# Altium schematic sheet TIDA-01576_ADS8686S_ISO_Interface_Pg5-Digital.SchDoc
size 431 x 279 mm; Date: Not shown in title block; ApprovedBy: Not shown in title block; CheckedBy: Not shown in title block; Author: Not shown in title block; CompanyName: Not shown in title block; Engineer: Not shown in title block; Organization: Not shown in title block; Address1: Not shown in title block; Address2: Not shown in title block; Address3: Not shown in title block; Address4: Not shown in title block; DocumentNumber: 1; Revision: Use project parameter SCH_Rev; SheetNumber: 5; SheetTotal: 8; PageSetup: Record=PageOptions|CenterHorizontal=True|CenterVertical=True|PrintScale=1.00|XCorrection=1.00|YCorrection=1.00|PrintKind=0|BorderSize=5000000|LeftOffset=0|BottomOffset=0|Orientation=2|PaperLength=1000|PaperWidth=1000|Scale=100|PaperSource=15|PrintQuality=600|MediaType=1|DitherType=10|PaperKind=Letter|PrintScaleMode=1; CurrentTime: Not shown in title block; CurrentDate: Not shown in title block; Time: Not shown in title block; DocumentFullPathAndName: Not shown in title block; DocumentName: Not shown in title block; ModifiedDate: Not shown in title block; ImagePath: Not shown in title block
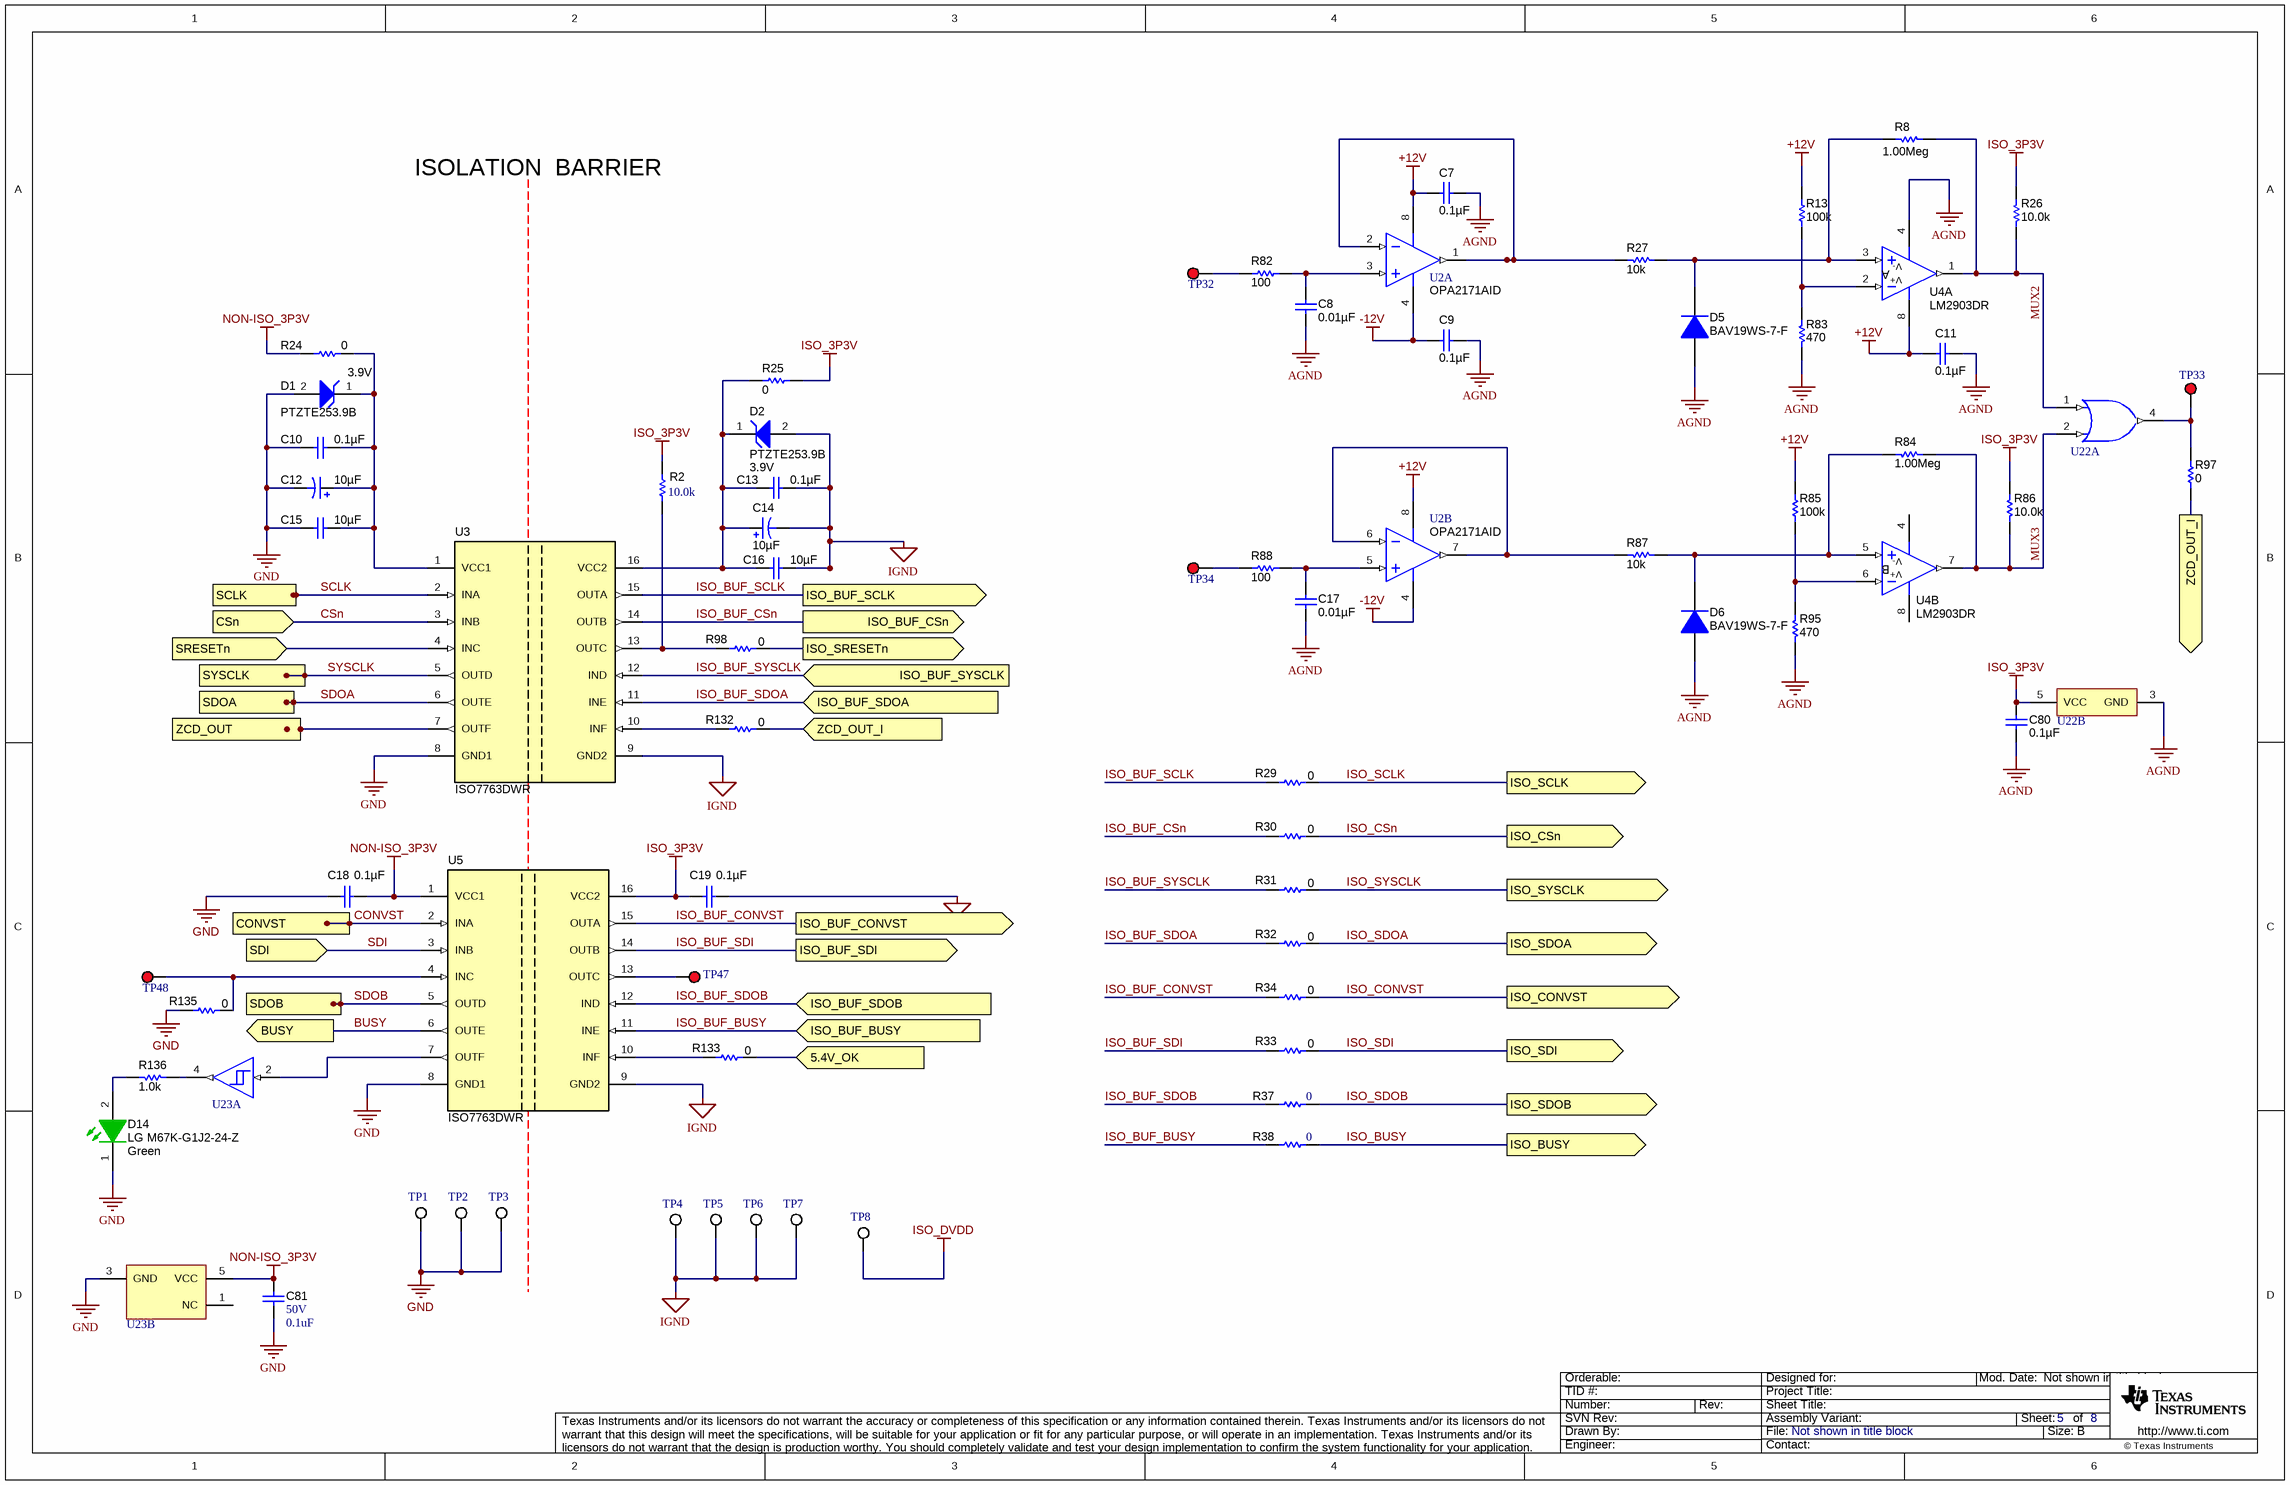
[diagram p0: TIDA-01576_ADS8686S_ISO_Interface_Pg5-Digital.SchDoc]

## Parts
C7  ValueDisplayed: 0.1µF  [0603]  (hidden comment: 06033C104JAT2A)
C8  ValueDisplayed: 0.01µF  [0603]  (hidden comment: C1608C0G1E103J080AA)
C9  ValueDisplayed: 0.1µF  [0603]  (hidden comment: 06033C104JAT2A)
C10  ValueDisplayed: 0.1µF  [0603]  (hidden comment: C0603C104K5RACTU)
C11  ValueDisplayed: 0.1µF  [0603]  (hidden comment: 06033C104JAT2A)
C12  ValueDisplayed: 10µF  [3528-21]  (hidden comment: T491B106K016AT)
C13  ValueDisplayed: 0.1µF  [0603]  (hidden comment: C0603C104K5RACTU)
C14  ValueDisplayed: 10µF  [3528-21]  (hidden comment: T491B106K016AT)
C15  ValueDisplayed: 10µF  [1206_180]  (hidden comment: GRM31CR61H106KA12L)
C16  ValueDisplayed: 10µF  [1206_180]  (hidden comment: GRM31CR61H106KA12L)
C17  ValueDisplayed: 0.01µF  [0603]  (hidden comment: C1608C0G1E103J080AA)
C18  ValueDisplayed: 0.1µF  [0402]  (hidden comment: GRM155R71C104KA88D)
C19  ValueDisplayed: 0.1µF  [0402]  (hidden comment: GRM155R71C104KA88D)
C80  ValueDisplayed: 0.1µF  [0603]  (hidden comment: 06033D104KAT2A)
C81  VDC_V: 50V  ValueDisplayed: 0.1uF  [0603]  (hidden comment: C0603C104K5RACTU)
D1  PTZTE253.9B  value 3.9V  [SMA]
D2  PTZTE253.9B  value 3.9V  [SMA]
D5  BAV19WS-7-F  [SOD-323]
D6  BAV19WS-7-F  [SOD-323]
D14  LG M67K-G1J2-24-Z  value Green  [LG_M67K_Green]
R2  ValueDisplayed: 10.0k  [0402]  (hidden comment: ERJ-2RKF1002X)
R8  value 1.00Meg  [0603]  (hidden comment: CRCW06031M00FKEA)
R13  ValueDisplayed: 100k  [0603]  (hidden comment: RC0603FR-07100KL)
R24  ValueDisplayed: 0  [0603]  (hidden comment: CRCW06030000Z0EA)
R25  ValueDisplayed: 0  [0603]  (hidden comment: CRCW06030000Z0EA)
R26  value 10.0k  [0603]  (hidden comment: CRCW060310K0FKEA)
R27  value 10k  [0603]  (hidden comment: CRCW060310K0FKEA)
R29  ValueDisplayed: 0  [0402]  (hidden comment: ERJ-2GE0R00X)
R30  ValueDisplayed: 0  [0402]  (hidden comment: ERJ-2GE0R00X)
R31  ValueDisplayed: 0  [0402]  (hidden comment: ERJ-2GE0R00X)
R32  ValueDisplayed: 0  [0402]  (hidden comment: ERJ-2GE0R00X)
R33  ValueDisplayed: 0  [0402]  (hidden comment: ERJ-2GE0R00X)
R34  ValueDisplayed: 0  [0402]  (hidden comment: ERJ-2GE0R00X)
R37  ValueDisplayed: 0  [0402]  (hidden comment: ERJ-2GE0R00X)
R38  ValueDisplayed: 0  [0402]  (hidden comment: ERJ-2GE0R00X)
R82  value 100  [0603]  (hidden comment: CRCW0603100RFKEA)
R83  ValueDisplayed: 470  [1206]  (hidden comment: RC1206FR-07470RL)
R84  value 1.00Meg  [0603]  (hidden comment: CRCW06031M00FKEA)
R85  ValueDisplayed: 100k  [0603]  (hidden comment: RC0603FR-07100KL)
R86  value 10.0k  [0603]  (hidden comment: CRCW060310K0FKEA)
R87  value 10k  [0603]  (hidden comment: CRCW060310K0FKEA)
R88  value 100  [0603]  (hidden comment: CRCW0603100RFKEA)
R95  ValueDisplayed: 470  [1206]  (hidden comment: RC1206FR-07470RL)
R97  ValueDisplayed: 0  [0402]  (hidden comment: ERJ-2GE0R00X)
R98  ValueDisplayed: 0  [0402]  (hidden comment: ERJ-2GE0R00X)
R132  ValueDisplayed: 0  [0402]  (hidden comment: ERJ-2GE0R00X)
R133  ValueDisplayed: 0  [0402]  (hidden comment: ERJ-2GE0R00X)
R135  ValueDisplayed: 0  [0402]  (hidden comment: ERJ-2GE0R00X)
R136  ValueDisplayed: 1.0k  [0603]  (hidden comment: RC0603JR-071KL)
TP1  5015  [Testpoint_Keystone_Miniature]  (value not drawn)
TP2  5015  [Testpoint_Keystone_Miniature]  (value not drawn)
TP3  5015  [Testpoint_Keystone_Miniature]  (value not drawn)
TP4  5015  [Testpoint_Keystone_Miniature]  (value not drawn)
TP5  5015  [Testpoint_Keystone_Miniature]  (value not drawn)
TP6  5015  [Testpoint_Keystone_Miniature]  (value not drawn)
TP7  5015  [Testpoint_Keystone_Miniature]  (value not drawn)
TP8  5015  [Testpoint_Keystone_Miniature]  (value not drawn)
TP32  5000  [Keystone5000]  (value not drawn)
TP33  5000  [Keystone5000]  (value not drawn)
TP34  5000  [Keystone5000]  (value not drawn)
TP47  5000  [Keystone5000]  (value not drawn)
TP48  5000  [Keystone5000]  (value not drawn)
U2  OPA2171AID  [D0008A_N]  (parts A,B of 2)
U3  ISO7763DWR  [DW0016B_HV]
U4  LM2903DR  [D0008A_N]  (parts A,B of 2)
U5  ISO7763DWR  [DW0016B_HV]
U22  SN74LVC1G32DBVR  [DBV0005A_N]  (value not drawn)  (parts A,B of 2)
U23  SN74LVC1G17DCKR  [DCK0005A_N]  (value not drawn)  (parts A,B of 2)

## Ports
5.4V_OK (in), BUSY (out), CONVST (in), CSn (in), ISO_BUF_BUSY (in), ISO_BUF_CONVST (out), ISO_BUF_CSn (out), ISO_BUF_SCLK (out), ISO_BUF_SDI (out), ISO_BUF_SDOA (in), ISO_BUF_SDOB (in), ISO_BUF_SYSCLK (in), ISO_BUSY (out), ISO_CONVST (out), ISO_CSn (out), ISO_SCLK (out), ISO_SDI (out), ISO_SDOA (out), ISO_SDOB (out), ISO_SRESETn (out), ISO_SYSCLK (out), SCLK (in), SDI (in), SDOA (out), SDOB (out), SRESETn (in), SYSCLK (out), ZCD_OUT (out), ZCD_OUT_I (in), ZCD_OUT_I (out)

## Nets
+12V: C7.2 C11.2 R13.2 R85.2 U2.8(V+) U4.8(V+)
-12V: C9.2 U2.4(V-)
AGND: C7.1 C8.1 C9.1 C11.1 C17.1 C80.2 D5.2(A) D6.2(A) R83.1 R95.1 U4.4(V-) U22.3(GND)
GND: C10.2 C12.2(-) C15.2 C18.1 C81.2 D1.2(A) D14.1(K) R135.1 TP1.1 TP2.1 TP3.1 U3.8(GND1) U5.8(GND1) U23.3(GND)
IGND: C13.2 C14.2(-) C16.1 C19.2 D2.2(A) TP4.1 TP5.1 TP6.1 TP7.1 U3.9(GND2) U5.9(GND2)
ISO_3P3V: C19.1 C80.1 R2.2 R25.1 R26.2 R86.2 U5.16(VCC2) U22.5(VCC)
ISO_DVDD: TP8.1
NON-ISO_3P3V: C18.2 C81.1 R24.2 U5.1(VCC1) U23.5(VCC)
5.4V_OK: R133.2 ; port 5.4V_OK
BUSY: U5.6(OUTE) ; port BUSY
CONVST: U5.2(INA) ; port CONVST
CSn: U3.3(INB) ; port CSn
ISO_BUF_BUSY: R38.1 U5.11(INE) ; port ISO_BUF_BUSY
ISO_BUF_CONVST: R34.1 U5.15(OUTA) ; port ISO_BUF_CONVST
ISO_BUF_CSn: R30.1 U3.14(OUTB) ; port ISO_BUF_CSn
ISO_BUF_SCLK: R29.1 U3.15(OUTA) ; port ISO_BUF_SCLK
ISO_BUF_SDI: R33.1 U5.14(OUTB) ; port ISO_BUF_SDI
ISO_BUF_SDOA: R32.1 U3.11(INE) ; port ISO_BUF_SDOA
ISO_BUF_SDOB: R37.1 U5.12(IND) ; port ISO_BUF_SDOB
ISO_BUF_SYSCLK: R31.1 U3.12(IND) ; port ISO_BUF_SYSCLK
ISO_BUSY: R38.2 ; port ISO_BUSY
ISO_CONVST: R34.2 ; port ISO_CONVST
ISO_CSn: R30.2 ; port ISO_CSn
ISO_SCLK: R29.2 ; port ISO_SCLK
ISO_SDI: R33.2 ; port ISO_SDI
ISO_SDOA: R32.2 ; port ISO_SDOA
ISO_SDOB: R37.2 ; port ISO_SDOB
ISO_SRESETn: R98.2 ; port ISO_SRESETn
ISO_SYSCLK: R31.2 ; port ISO_SYSCLK
MUX2: R8.1 R26.1 U4.1(OUT) U22.1(A)
MUX3: R84.1 R86.1 U4.7(OUT) U22.2(B)
SCLK: U3.2(INA) ; port SCLK
SDI: U5.3(INB) ; port SDI
SDOA: U3.6(OUTE) ; port SDOA
SDOB: U5.5(OUTD) ; port SDOB
SRESETn: U3.4(INC) ; port SRESETn
SYSCLK: U3.5(OUTD) ; port SYSCLK
ZCD_OUT: U3.7(OUTF) ; port ZCD_OUT
ZCD_OUT_I: R97.1 R132.2 ; port ZCD_OUT_I
NetC8_2: C8.2 R82.2 U2.3(IN_A+)
NetC10_1: C10.1 C12.1(+) C15.1 D1.1(K) R24.1 U3.1(VCC1)
NetC13_1: C13.1 C14.1(+) C16.2 D2.1(K) R25.2 U3.16(VCC2)
NetC17_2: C17.2 R88.2 U2.5(IN_B+)
NetD5_1: D5.1(K) R8.2 R27.2 U4.3(IN+)
NetD6_1: D6.1(K) R84.2 R87.2 U4.5(IN+)
NetD14_2: D14.2(A) R136.2
NetR2_1: R2.1 R98.1 U3.13(OUTC)
NetR13_1: R13.1 R83.2 U4.2(IN-)
NetR27_1: R27.1 U2.1(OUT_A) U2.2(IN_A-)
NetR82_1: R82.1 TP32.1
NetR85_1: R85.1 R95.2 U4.6(IN-)
NetR87_1: R87.1 U2.6(IN_B-) U2.7(OUT_B)
NetR88_1: R88.1 TP34.1
NetR97_2: R97.2 TP33.1 U22.4(Y)
NetR132_1: R132.1 U3.10(INF)
NetR133_1: R133.1 U5.10(INF)
NetR135_2: R135.2 TP48.1 U5.4(INC)
NetR136_1: R136.1 U23.4(Y)
NetTP47_1: TP47.1 U5.13(OUTC)
NetU5_7: U5.7(OUTF) U23.2(A)

Not connected (* = marked no-connect by the designer): U23 1(NC)

## Notes on the sheet
- ISOLATION  BARRIER
- Drawn By:
- SVN Rev:
- Number:
- TID #:
- Orderable:
- Rev:
- Sheet Title:
- File:
- Project Title:
- Designed for:
- Assembly Variant:
- Mod. Date:
- Sheet:
- Size:
- of
- B
- http://www.ti.com
- Texas Instruments and/or its licensors do not warrant the accuracy or completeness of this specification or any information contained therein. Texas Instruments and/or its licensors do not warrant that this design will meet the specifications, will be suitable for your application or fit for any particular purpose, or will operate in an implementation. Texas Instruments and/or its licensors do not warrant that the design is production worthy. You should completely validate and test your design implementation to confirm the system functionality for your application.
- Engineer:
- Contact:
- © Texas Instruments
- (in symbol LM2903D, part A) A
- (in symbol LM2903D, part B) B

## Library data of the parts
C7 C9 C11 = 06033C104JAT2A: CAP, CERM, 0.1uF, 25V, +/-5%, X7R, 0603; Manufacturer: AVX; Polarized: N; CompType: Capacitor; U/M: EA; Cap_F: 0.0000001; Tolerance_%: 5; ESR_Ohm: 0.05; Value1: 0.05 ohm; VDC_V: 25; TaMin_C: -55; TaMax_C: 125; SymbolVersion: 2008-07-09; Value: 0.1uF; PartNumber: 06033C104JAT2A; PackageReference: 0603; RoHS: Y; Value2: 25V; MountType: SMT; Technology: Ceramic; TempCo: X7R; Cap_Case: 0603; Published: 2008-06-19; Publisher: Texas Instruments; LatestRevisionDate: 2013-12-06; ComponentLink1Description: Datasheet link; ComponentLink1URL: http://www.avx.com/docs/masterpubs/smccp.pdf; Supplier 1: Digi-Key; Supplier Part Number 1: 478-3713-1-ND; Supplier 2: Mouser; Supplier Part Number 2: 581-06033C104JAT2A; Supplier 3: Farnell; Supplier Part Number 3: 1740614
C8 C17 = C1608C0G1E103J: CAP, CERM, 0.01uF, 25V, +/-5%, C0G/NP0, 0603; Manufacturer: TDK; Polarized: N; CompType: Capacitor; U/M: EA; Cap_F: 0.00000001; Tolerance_%: 5; Value1: Unknown; VDC_V: 25; TaMin_C: -55; TaMax_C: 125; SymbolVersion: 2008-07-09; Value: 0.01uF; PartNumber: C1608C0G1E103J080AA; PackageReference: 0603; RoHS: Y; Value2: 25V; MountType: SMT; Technology: Ceramic; TempCo: C0G/NP0; Cap_Case: 0603; Published: 2008-06-19; Publisher: Texas Instruments; LatestRevisionDate: 2013-12-06; ComponentLink1Description: Datasheet link; ComponentLink1URL: http://www.tdk.co.jp/tefe02/e412_c.pdf; Supplier 1: Digi-Key; Supplier Part Number 1: 445-2664-1-ND; Supplier 2: Farnell; Supplier Part Number 2: 1844146
C10 C13 = C0603C104K5RACTU: CAP, CERM, 0.1uF, 50V, +/-10%, X7R, 0603; Manufacturer: Kemet; Polarized: N; CompType: Capacitor; U/M: EA; Cap_F: 0.0000001; Tolerance_%: 10; Value1: Unknown; VDC_V: 50; TaMin_C: -55; TaMax_C: 125; SymbolVersion: 2008-07-09; Value: 0.1uF; PartNumber: C0603C104K5RACTU; PackageReference: 0603; RoHS: Y; Value2: 50V; MountType: SMT; Technology: Ceramic; TempCo: X7R; Cap_Case: 0603; Published: 2008-06-19; Publisher: Texas Instruments; LatestRevisionDate: 2013-12-06; ComponentLink1Description: Datasheet link; ComponentLink1URL: http://www.kemet.com/kemet/web/homepage/kechome.nsf/vapubfiles/F3102_Y5V.pdf/$file/F3102_Y5V.pdf; Supplier 1: Digi-Key; Supplier Part Number 1: 399-5089-1-ND; Supplier 2: Mouser; Supplier Part Number 2: 80-C0603C104K5R; Supplier 3: Farnell; Supplier Part Number 3: 1288255
C12 C14 = 293D106X9016B2TE3: CAP, TA, 10 µF, 16 V, +/- 10%, 2 ohm, SMD; Manufacturer: Vishay-Sprague; Polarized: Y; CompType: Capacitor; Value: 10uF; U/M: EA; Cap_F: 0.00001; Tolerance_%: 10; Value1: 2 ohm; VDC_V: 16; Value2: 16V; ESR_ohm: 2; IRMS_A: 0.21; TaMin_C: -55; TaMax_C: 125; Cap_Case: B; SymbolVersion: 2008-07-09; PartNumber: T491B106K016AT; PackageReference: 3528-21; RoHS: Y; MountType: SMT; Technology: TA; Series: 293D; Publisher: Texas Instruments; LatestRevisionDate: 2014-08-11; LatestRevisionNote: Updated supplier links; ComponentLink1Description: Datasheet link; ComponentLink1URL: http://www.vishay.com/docs/40002/293d.pdf; Supplier 1: Digi-Key; Supplier Part Number 1: 399-3706-1-ND
C15 C16 = GRM31CR61H106KA12L: CAP, CERM, 10 µF, 50 V, +/- 10%, X5R, 1206; Manufacturer: MuRata; Polarized: N; CompType: Capacitor; Value: 10uF; U/M: EA; Cap_F: 0.00001; Tolerance_%: 10; Value1: Unknown; VDC_V: 50; Value2: 50V; TaMin_C: -55; TaMax_C: 85; Cap_Case: 1206; SizeArea_mm2: 5.12; SizeAreaWB_mm2: 10.92; SizeX_mm: 3.2; SizeY_mm: 1.6; SizeZ_mm: 1.8; AEC Category: Q200; SymbolVersion: 2008-07-09; PartNumber: GRM31CR61H106KA12L; PackageReference: 1206; RoHS: Y; MountType: SMT; Technology: Ceramic; TempCo: X5R; Published: 2008-06-19; Publisher: Texas Instruments; LatestRevisionDate: 2016-10-28; ComponentLink1Description: Datasheet link; ComponentLink1URL: http://search.murata.co.jp/Ceramy/image/img/A01X/G101/ENG/GRM31CR61H106KA12-01.pdf; Supplier 1: Digi-Key; Supplier Part Number 1: 490-5961-1-ND; Supplier 2: Mouser; Supplier Part Number 2: 81-GRM31CR61H106KA2L; Supplier 3: Farnell; Supplier Part Number 3: 1845762RL; AEC Qualified: N; AEC Grade: N/A
C18 C19 = GRM155R71C104KA88D: CAP, CERM, 0.1 µF, 16 V, +/- 10%, X7R, 0402; Manufacturer: MuRata; Polarized: N; CompType: Capacitor; Value: 0.1uF; U/M: EA; Cap_F: 0.0000001; Tolerance_%: 10; Value1: Unknown; VDC_V: 16; Value2: 16V; TaMin_C: -55; TaMax_C: 125; SymbolVersion: 2008-07-09; PartNumber: GRM155R71C104KA88D; PackageReference: 0402; RoHS: Y; MountType: SMT; Technology: Ceramic; TempCo: X7R; Cap_Case: 0402; Published: 2008-06-19; Publisher: Texas Instruments; LatestRevisionDate: 2015-07-09; ComponentLink1Description: Datasheet link; ComponentLink1URL: http://search.murata.co.jp/Ceramy/PnsearchViewAction.do?HnOFG=ON&HnNFG=ON&SEL_CNT=50&sLang=en&sKey=GRM155R71C104KA88D&x=9&y=9&search=startwith; Supplier 1: Digi-Key; Supplier Part Number 1: 490-3261-1-ND; Supplier 2: Mouser; Supplier Part Number 2: 81-GRM155R71C104KA88; Supplier 3: Farnell; Supplier Part Number 3: 8819742
C80 = 06033D104KAT2A: CAP, CERM, 0.1 µF, 25 V,+/- 10%, X5R, 0603; Manufacturer: AVX; Polarized: N; CompType: Capacitor; Value: 0.1uF; U/M: EA; Cap_F: 0.0000001; Tolerance_%: 10; ESR_ohm: 0.048; Value1: 0.048 ohm; VDC_V: 25; Value2: 25V; IRMS_A: 0.53; TaMin_C: -55; TaMax_C: 85; SizeArea_mm2: 1.28; SizeAreaWB_mm2: 4.68; SizeX_mm: 1.6; SizeY_mm: 0.8; SizeZ_mm: 1; AEC Category: Q200; Green_Lifecycle: Active; Green_REACh: Passed; SymbolVersion: 2008-07-09; PartNumber: 06033D104KAT2A; PackageReference: 0603; RoHS: Y; MountType: SMT; Technology: Ceramic; TempCo: X5R; Cap_Case: 0603; Published: 2008-06-19; Publisher: Texas Instruments; LatestRevisionDate: 2017-06-22; ComponentLink1Description: Datasheet link; ComponentLink1URL: http://datasheets.avx.com/cx5r.pdf; Supplier 1: Digi-Key; Supplier Part Number 1: 478-1244-1-ND; Supplier 2: Mouser; Supplier Part Number 2: 581-06033D104K; AEC Qualified: N; AEC Grade: N/A; Green_EU RoHS: Passed; Green_EU RoHS-2: Incomplete
C81 = CMP-0006861-4: CAP, CERM, 0.1 uF, 50 V, +/- 10%, X7R, 0603; Manufacturer: Kemet; TaMin_C: -55°C; Polarized: N; SizeAreaWB_mm2: 4.68; Value1: Unknown; U/M: EA; Value: 0.1uF; TaMax_C: 125°C; SizeZ_mm: 1; SizeX_mm: 1.6; SizeY_mm: 0.8; SizeArea_mm2: 1.28; Cap_F: 100nF; AEC Category: Q200; Supplier Part Number 2: 80-C0603C104K5R; Publisher: Texas Instruments; Supplier 2: Mouser; Supplier Part Number 3: 1288255; TempCo: X7R; Supplier 3: Farnell; Published: 2008-06-19; RoHS: Y; MountType: SMT; Supplier 1: Digi-Key; PackageReference: 0603; Tolerance_%: 10%; Cap_Case: 0603; Value2: 50V; CompType: Capacitor; LatestRevisionDate: 2017-03-09; PartNumber: C0603C104K5RACTU; AEC Qualified: ?; ComponentLink1Description: Datasheet link; Supplier Part Number 1: 399-5089-1-ND; Technology: Ceramic; ComponentLink1URL: http://www.kemet.com/kemet/web/homepage/kechome.nsf/vapubfiles/F3102_Y5V.pdf/$file/F3102_Y5V.pdf
D1 D2 = PTZTE255.6B: DIODE ZENER 4.1V 1W PMDS; Manufacturer: Rohm Semiconductor; U/M: EA; Vz_V: 3.9; PartNumber: PTZTE253.9B; PackageReference: DO-214AC, SMA; CompType: Zener; Vr_V: N/A; Value1: 1W; MountType: SMT; RoHS: Y; ComponentLink1Description: Datasheet link; ComponentLink1URL: http://rohmfs.rohm.com/en/products/databook/datasheet/discrete/diode/zener/ptz5.6b.pdf; Publisher: Texas Instruments; Supplier 1: Digi-Key; Supplier Part Number 1: PTZTE253.9BCT-ND
D5 D6 = BAV19WS-7-F: Diode, Switching, 100 V, 0.2 A, SOD-323; Manufacturer: Diodes Inc.; U/M: EA; Vf_V: 1.25; Value: 100V; Value1: 0.2A; Value2: 1.25V; Io_A: 0.2; Vr_V: 100; TJmax_C: 150; SizeAreaWB_mm2: 8.695; SizeArea_mm2: 3.645; SizeX_mm: 2.7; SizeY_mm: 1.35; SizeZ_mm: 1; AEC Category: Q101; SymbolVersion: 2008-12-08; PartNumber: BAV19WS-7-F; PackageReference: SOD-323; CompType: Diode; MountType: SMT; Type: Switching; RoHS: Y; Published: 2008-06-26; Publisher: Texas Instruments; LatestRevisionDate: 2016-07-19; ComponentLink1Description: Datasheet link; ComponentLink1URL: http://www.diodes.com/datasheets/ds30119.pdf; Supplier 1: Digi-Key; Supplier Part Number 1: BAV19WS-FDICT-ND; Supplier 2: Mouser; Supplier Part Number 2: 621-BAV19WS-F; AEC Qualified: ?
D14 = LG M67K-G1J2-24-Z: LED, Green, SMD; Manufacturer: OSRAM; SymbolCreator: Altium; Type: AlInGaP; Vf_V: 1.8; Value2: 1.8V; Io_A: 0.002; Vr_V: 12; Tjmax_C: 125; Value1: W; Angle: 120; U/M: EA; SymbolVersion: 2015-01-20; PartNumber: LG M67K-G1J2-24-Z; PackageReference: 2x1.4mm; RoHS: Y; CompType: LED; MountType: SMT; Color: Green; Published: 2008-07-11; Publisher: Texas Instruments; ComponentLink1URL: http://www.digikey.com/product-detail/en/LG%20M67K-G1J2-24-Z/475-1406-1-ND/1802594; ComponentLink1Description: Datasheet link; LatestRevisionDate: 2016-09-26; Supplier 1: Digi-Key; Supplier Part Number 1: 475-1406-1-ND; Supplier 2: Mouser; Supplier Part Number 2: 720-LGM67KG1J224Z
R2 = CMP-0026658-1: RES, 10.0 k, 1%, 0.1 W, 0402; Manufacturer: Panasonic; Power_W: 100mW; TempCo: 100 ppm/C; Value_Code: 10k0; U/M: EA; Value: 10.0k; EIA_Code: E96; Res_ohm: 10k; SizeX_mm: 1; SizeY_mm: 0.5; SizeZ_mm: 0.6; Value2: 0.1W; VDC_V: 50V; AEC Category: Q200; ComponentLink1URL: http://industrial.panasonic.com/www-data/pdf/AOA0000/AOA0000CE2.pdf; Supplier Part Number 2: 90W2949; Publisher: Texas Instruments; Supplier 2: Newark; Supplier Part Number 3: 667-ERJ-2RKF1002X; Supplier 3: Mouser; Published: 2008-06-26; RoHS: Y; Value1: 1%; MountType: SMT; Supplier 1: Digi-Key; PackageReference: 0402; Tolerance_%: 1%; SizeArea_mm2: 0.5; CompType: Resistor; LatestRevisionDate: 2017-03-09; PartNumber: ERJ-2RKF1002X; AEC Qualified: ?; ComponentLink1Description: Datasheet link; Supplier Part Number 1: P10.0KLCT-ND; Technology: Thick Film
R8 R84 = CRCW06031M00FKEA: RES, 1.00Meg ohm, 1%, 0.1W, 0603; Manufacturer: Vishay-Dale; CompType: Resistor; Res_ohm: 1000000; Value_Code: 1M00; Tolerance_%: 1; Power_W: 0.1; VDC_V: 75; TempCo: 100 ppm/C; EIA_Code: E96; U/M: EA; SymbolVersion: 2009-05-29; PartNumber: CRCW06031M00FKEA; PackageReference: 0603; RoHS: Y; Value1: 1%; Value2: 0.1W; MountType: SMT; Technology: Thick Film; Published: 2008-06-26; Publisher: Texas Instruments; LatestRevisionDate: 2014-03-01; ComponentLink1Description: Datasheet link; ComponentLink1URL: http://www.vishay.com/docs/20035/dcrcwe3.pdf; Supplier 1: Digi-Key; Supplier Part Number 1: 541-1.00MHCT-ND; Supplier 2: Mouser; Supplier Part Number 2: 71-CRCW0603-1.0M-E3; Supplier 3: Farnell; Supplier Part Number 3: 1469746
R13 R85 = RC0603FR-07100KL: RES, 100 k, 1%, 0.1 W, 0603; Manufacturer: Yageo America; CompType: Resistor; Value: 100k; Res_ohm: 100000; Tolerance_%: 1; Power_W: 0.1; Value2: 0.1W; VDC_V: 150; TempCo: 200 ppm/C; EIA_Code: E96; U/M: EA; AEC Category: Q200; SymbolVersion: 2009-05-29; PartNumber: RC0603FR-07100KL; PackageReference: 0603; RoHS: Y; Value_Code: 100k; Value1: 1%; MountType: SMT; Technology: Thick Film; Published: 2008-06-26; Publisher: Texas Instruments; LatestRevisionDate: 2015-10-07; ComponentLink1Description: Datasheet link; ComponentLink1URL: http://www.yageo.com/pdf/Pu-RC0603_51_PbFree_L_2.pdf; Supplier 1: Digi-Key; Supplier Part Number 1: 311-100KHRCT-ND; Supplier 2: Mouser; Supplier Part Number 2: 603-RC0603FR-07100KL; Supplier 3: Farnell; Supplier Part Number 3: 9238727; AEC Qualified: ?
R24 R25 = CRCW06030000Z0EA: RES, 0, 5%, 0.1 W, 0603; Manufacturer: Vishay-Dale; CompType: Resistor; Value: 0; Value_Code: 0000; Tolerance_%: 5; Power_W: 0.1; Value2: 0.1W; VDC_V: 75; TempCo: 200 ppm/C; EIA_Code: E24; U/M: EA; SymbolVersion: 2009-05-29; PartNumber: CRCW06030000Z0EA; PackageReference: 0603; RoHS: Y; Res_ohm: 0; Value1: 5%; MountType: SMT; Technology: Thick Film; Published: 2008-06-26; Publisher: Texas Instruments; LatestRevisionDate: 2014-10-21; ComponentLink1Description: Datasheet link; ComponentLink1URL: http://www.vishay.com/docs/20035/dcrcwe3.pdf; Supplier 1: Digi-Key; Supplier Part Number 1: 541-0.0GCT-ND; Supplier 2: Mouser; Supplier Part Number 2: 71-CRCW0603-0-E3; Supplier 3: Farnell; Supplier Part Number 3: 1469739
R26 R86 = CRCW060310K0FKEA: RES, 10.0k ohm, 1%, 0.1W, 0603; Manufacturer: Vishay-Dale; CompType: Resistor; Res_ohm: 10000; Value_Code: 10k0; Tolerance_%: 1; Power_W: 0.1; VDC_V: 75; TempCo: 100 ppm/C; EIA_Code: E96; U/M: EA; SymbolVersion: 2009-05-29; PartNumber: CRCW060310K0FKEA; PackageReference: 0603; RoHS: Y; Value1: 1%; Value2: 0.1W; MountType: SMT; Technology: Thick Film; Published: 2008-06-26; Publisher: Texas Instruments; LatestRevisionDate: 2013-10-22; ComponentLink1Description: Datasheet link; ComponentLink1URL: http://www.vishay.com/docs/20035/dcrcwe3.pdf; Supplier 1: Digi-Key; Supplier Part Number 1: 541-10.0KHCT-ND; Supplier 2: Mouser; Supplier Part Number 2: 71-CRCW0603-10K-E3; Supplier 3: Farnell; Supplier Part Number 3: 1469748
R27 R87 = RNCF0603TKY10K0: RES, 10.0k ohm, 1%, 0.1W, 0603; Manufacturer: Stackpole Electronics Inc; CompType: Resistor; Res_ohm: 10000; Value_Code: 10k0; Tolerance_%: 0.01; Value1: 0.01%; Power_W: 0.063; Value2: 0.063W; VDC_V: 50; TempCo: 5 ppm/C; U/M: EA; SymbolVersion: 2009-05-29; PartNumber: CRCW060310K0FKEA; PackageReference: 0603; RoHS: Y; MountType: SMT; Technology: Thin Film; Published: 2008-06-26; Publisher: Texas Instruments; LatestRevisionDate: 2013-10-22; ComponentLink1Description: Datasheet link; ComponentLink1URL: http://www.seielect.com/Catalog/SEI-RNCF.pdf; Supplier 1: Digi-Key; Supplier Part Number 1: 541-10.0KHCT-ND
R29-R34 R97 R98 R132 R133 R135 = ERJ-2GE0R00X: RES, 0, 5%, 0.063 W, 0402; Manufacturer: Panasonic; CompType: Resistor; Value: 0; Value_Code: 0000; Tolerance_%: 5; Power_W: 0.063; Value2: 0.063W; VDC_V: 50; TempCo: 600 ppm/C; EIA_Code: E24; U/M: EA; AEC Category: Q200; SymbolVersion: 2009-05-29; PartNumber: ERJ-2GE0R00X; PackageReference: 0402; RoHS: Y; Res_ohm: 0; Value1: 5%; MountType: SMT; Technology: Thick Film; Published: 2008-06-26; Publisher: Texas Instruments; LatestRevisionDate: 2015-10-23; ComponentLink1Description: Datasheet link; ComponentLink1URL: http://www.panasonic.com/industrial/components/pdf/AOA0000CE1.pdf; Supplier 1: Digi-Key; Supplier Part Number 1: P0.0JCT-ND; Supplier 2: Mouser; Supplier Part Number 2: 667-ERJ-2GE0R00X; Supplier 3: Farnell; Supplier Part Number 3: 2059190; AEC Qualified: ?
R37 R38 = CMP-0026992-3: RES, 0, 5%, 0.1 W, AEC-Q200 Grade 0, 0402; Manufacturer: Panasonic; Power_W: 100mW; TempCo: 600 ppm/C; Value_Code: 0000; Value: 0; EIA_Code: E24; SizeX_mm: 1; SizeY_mm: 0.5; SizeZ_mm: 0.6; Value2: 0.1W; AEC Qualified: Y; VDC_V: 50V; AEC Category: Q200; SizeAreaWB_mm2: 3; Supplier Part Number 2: 65T8307; Supplier 2: Newark; Supplier Part Number 3: 667-ERJ-2GE0R00X; Supplier 3: Mouser; RoHS: Y; Value1: 5%; MountType: SMT; Supplier 1: Digi-Key; PackageReference: 0402; Tolerance_%: 5%; Res_ohm: 0; SizeArea_mm2: 0.5; CompType: Resistor; PartNumber: ERJ-2GE0R00X; ComponentLink1Description: Datasheet link; Supplier Part Number 1: P0.0JCT-ND; Technology: Thick Film; ComponentLink1URL: https://industrial.panasonic.com/cdbs/www-data/pdf/RDA0000/AOA0000C301.pdf; AEC Grade: 0
R82 R88 = CRCW0603100RFKEA: RES, 100 ohm, 1%, 0.1W, 0603; Manufacturer: Vishay-Dale; CompType: Resistor; Value_Code: 100R; Tolerance_%: 1; Power_W: 0.1; VDC_V: 75; TempCo: 100 ppm/C; EIA_Code: E96; U/M: EA; SymbolVersion: 2009-05-29; PartNumber: CRCW0603100RFKEA; PackageReference: 0603; RoHS: Y; Res_ohm: 100; Value1: 1%; Value2: 0.1W; MountType: SMT; Technology: Thick Film; Published: 2008-06-26; Publisher: Texas Instruments; LatestRevisionDate: 2013-10-22; ComponentLink1Description: Datasheet link; ComponentLink1URL: http://www.vishay.com/docs/20035/dcrcwe3.pdf; Supplier 1: Digi-Key; Supplier Part Number 1: 541-100HCT-ND; Supplier 2: Mouser; Supplier Part Number 2: 71-CRCW0603-100-E3; Supplier 3: Farnell; Supplier Part Number 3: 1469752
R83 R95 = RC1206FR-07470RL: RES, 470, 1%, 0.25 W, 1206; Manufacturer: Yageo America; CompType: Resistor; Value_Code: 470R; Tolerance_%: 1; Power_W: 0.25; Value2: 0.25W; VDC_V: 200; TempCo: 100 ppm/C; U/M: EA; Value: 470; SizeArea_mm2: 5.12; SizeX_mm: 3.2; SizeY_mm: 1.6; SizeZ_mm: 1.35; AEC Category: Q200; SymbolVersion: 2009-05-29; PartNumber: RC1206FR-07470RL; PackageReference: 1206; RoHS: Y; Res_ohm: 470; Value1: 1%; MountType: SMT; Technology: Thick Film; Published: 2008-06-26; Publisher: Texas Instruments; LatestRevisionDate: 2017-06-12; ComponentLink1Description: Datasheet link; ComponentLink1URL: http://www.yageo.com/pdf/Pu-RC1206_51_PbFree_L_2.pdf; Supplier 1: Digi-Key; Supplier Part Number 1: 311-470FRCT-ND; Supplier 2: Mouser; Supplier Part Number 2: 603-RC1206FR-07470RL; Supplier 3: Farnell; Supplier Part Number 3: 9240926; AEC Qualified: ?
R136 = RC0603JR-071KL: RES, 1.0 k, 5%, 0.1 W, 0603; Manufacturer: Yageo America; CompType: Resistor; Value: 1.0k; Res_ohm: 1000; Value_Code: 1k00; Tolerance_%: 5; Power_W: 0.1; Value2: 0.1W; VDC_V: 50; TempCo: 100 ppm/C; SizeArea_mm2: 1.28; SizeX_mm: 1.6; SizeY_mm: 0.8; SizeZ_mm: 1; EIA_Code: E24; U/M: EA; AEC Category: Q200; Green_Lifecycle: Active; Green_REACh: Passed; SymbolVersion: 2009-05-29; PartNumber: RC0603JR-071KL; PackageReference: 0603; RoHS: Y; Value1: 5%; MountType: SMT; Technology: Thick Film; Published: 2008-06-26; Publisher: Texas Instruments; LatestRevisionDate: 2017-06-13; ComponentLink1Description: Datasheet link; ComponentLink1URL: http://www.yageo.com/pdf/Pu-RC0603_51_PbFree_L_2.pdf; Supplier 1: Digi-Key; Supplier Part Number 1: 311-1.0KGRCT-ND; Supplier 2: Mouser; Supplier Part Number 2: 603-RC0603JR-071KL; Supplier 3: Farnell; Supplier Part Number 3: 9233385; AEC Qualified: ?; Green_EU RoHS: Passed with Exemption; Green_EU RoHS-2: Passed
TP1-TP8 = 5015: Test Point, Miniature, SMT; Manufacturer: Keystone; CompType: Test Point Loop; SymbolVersion: 2008-07-10; PartNumber: 5015; PackageReference: Testpoint_Keystone_Miniature; RoHS: Y; MountType: SMT; ComponentLink1Description: Datasheet URL; ComponentLink1URL: http://www.keyelco.com/userAssets/store/files/5015.PDF; Publisher: Texas Instruments; LatestRevisionDate: 2016-02-11; Supplier 1: Digi-Key; Supplier Part Number 1: 36-5015TR-ND; Supplier 2: Mouser; Supplier Part Number 2: 534-5015
TP32 TP34 TP47 TP48 = 5000: Test Point, Miniature, Red, TH; Manufacturer: Keystone; CompType: Test Point Loop; ContactFinish: Silver; Green_Lifecycle: Active; Green_REACh: Passed; SymbolVersion: 2008-04-04; PartNumber: 5000; PackageReference: Red Miniature Testpoint; RoHS: Y; MountType: TH; ComponentLink1Description: Datasheet URL; ComponentLink1URL: http://www.keyelco.com/userAssets/file/M60-2p60.pdf; Color: Red; Publisher: Texas Instruments; LatestRevisionDate: 2017-05-11; Supplier 1: Digi-Key; Supplier Part Number 1: 36-5000-ND; Supplier 2: Mouser; Supplier Part Number 2: 534-5000; Green_EU RoHS: Passed; Green_EU RoHS-2: Incomplete
TP33 = 5000: Test Point, Miniature, Red, TH; Manufacturer: Keystone; CompType: Test Point Loop; ContactFinish: Silver; SymbolVersion: 2008-04-04; PartNumber: 5000; PackageReference: Red Miniature Testpoint; RoHS: Y; MountType: TH; ComponentLink1Description: Datasheet URL; ComponentLink1URL: http://www.keyelco.com/userAssets/file/M60-2p60.pdf; Color: Red; Publisher: Texas Instruments; LatestRevisionDate: 2016-02-11; Supplier 1: Digi-Key; Supplier Part Number 1: 36-5000-ND; Supplier 2: Mouser; Supplier Part Number 2: 534-5000
U2 = CMP-0040593-1: Low Power, RRO, General Purpose Operational Amplifier in MicroPackage, 2.7 to 36 V, -40 to 125 degC, 8-pin SOIC (D8), Green (RoHS & no Sb/Br); Manufacturer: Texas Instruments; CMRR(Min)(dB): 104; Total Supply Voltage(Min)(+5V is 5, +/-5V is 10): 2.7; Slew Rate(Typ)(V/us): 1.5; IIB(Max)(pA): 15; Offset Drift(Typ)(uV/C): 0.3; Vio (25C)(Max)(mV): 1.8; Packing: TUBE; Total Supply Voltage(Max)(+5V is 5, +/-5V is 10): 36; Number of Channels: 2; GBW(Typ)(MHz): 3; Iq per channel(Max)(mA): 0.595; Sub Family: High Supply Voltage Amplifier (>=30V), Low Supply Voltage Amplifier (<=2.7V), Precision Amplifier; Rating: Catalog; ComponentLink1Description: Manufacturer URL; PartNumber: OPA2171AID; PackageDescription: 8-Pin Plastic Small Outline, Body 4.9 x 3.9 mm, Pitch 1.27 mm; PackageReference: D0008A; Code_JEDEC: MS-012; Mounting Technology: Surface Mount; Eco-Plan: Green (RoHS & no Sb/Br); ComponentLink2Description: Datasheet; PackageVersion: 4040047-3/M, 06/2011; ComponentLink3URL: http://www.ti.com/litv/pdf/msoi002j; DatasheetVersion: SBOS516D; ComponentLink3Description: Package Specification; ComponentLink2URL: http://www.ti.com/lit/ds/symlink/opa2171.pdf; ComponentLink1URL: http://www.ti.com/; PartId: 1
U3 U5 = CMP-0078433-2: High Speed, Robust EMC, Reinforced Six-Channel Digital Isolator, DW0016B (SOIC-16); Alternate Manufacturer: Texas Instruments; CompType: IC; SizeAreaWB_mm2: 152.52; SizeX_mm: 10.4; AEC Category: Q200; SizeZ_mm: 2.65; SizeArea_mm2: 107.12; AEC Qualified: N; SizeY_mm: 10.3; Rating: Catalog; ComponentLink3Description: Online Datasheet; ComponentLink2Description: Product Folder; PartNumber: ISO7763DWR; MountType: SMT; ComponentLink2URL: http://www.ti.com/product/iso7763; PackageReference: DW0016B; Alternate PartNumber: ISO7763DW; ComponentLink3URL: http://www.ti.com/product/GPN/datasheet; ComponentLink1URL: http://www.ti.com/lit/ds/symlink/iso7763.pdf; RoHS: Y; Operating Temperature Range: -55 to 125 C; Manufacturer: Texas Instruments; ComponentLink1Description: Datasheet Link; PackageDescription: SOIC-16
U4 = LM2903D: Dual Comparator, D0008A; Manufacturer: Texas Instruments; CompType: OpAmp IC; SymbolVersion: 2013-12-03; PartNumber: LM2903DR; PackageReference: D0008A; MountType: SMT; Publisher: Texas Instruments; LatestRevisionDate: 2016-06-02; Alternate Manufacturer: Texas Instruments; ComponentLink1Description: LM2903 Datasheet; ComponentLink1URL: http://www.ti.com/lit/gpn/LM193; ComponentLink2Description: LM2903 Web Page; ComponentLink2URL: http://www.ti.com/product/LM2903; ComponentLink3Description: SOIC Package Web Page; ComponentLink3URL: http://www.ti.com/sc/docs/psheets/type/soic.html; Supplier Part Number 1: 296-16806-1-ND; Supplier 1: Digi-Key
U22 = CMP-0051622-1: Single 2-Input Positive-OR Gate, DBV0005A, LARGE T&R; Manufacturer: Texas Instruments; VCC(Min)(V): 1.65; Sub-Family: OR Gate; Schmitt Trigger: No; VCC(Max)(V): 5.5; Technology Family: LVC; F @ Nom Voltage(Max)(Mhz): 150; Input Type: CMOS/TTL; Output Drive (IOL/IOH)(Max)(mA): 32/-32; Rating: Catalog; Output Type: CMOS; Voltage(Nom)(V): 1.8,2.5,3.3,5; Bits(#): 1; tpd @ Nom Voltage(Max)(ns): 7.2,4.4,3.6,3.4; ICC @ Nom Voltage(Max)(mA): 0.01; Logic: True; Operating Temperature Range(C): -40 to 125,-40 to 85; DatasheetVersion: SCES219U; PartNumber: SN74LVC1G32DBVR; PackageReference: DBV0005A; 3-State Output: No; PartId: 1
U23 = CMP-0051704-1: Single Schmitt-Trigger Buffer, DCK0005A, LARGE T&R; Manufacturer: Texas Instruments; tpd @ Nom Voltage(Max)(ns): 11,6.5,5.5,5; Bits(#): 1; VCC(Min)(V): 1.65; F @ Nom Voltage(Max)(Mhz): 150; VCC(Max)(V): 5.5; Input Type: CMOS/TTL; Sub-Family: Non-Inverting Buffer/Driver; Output Type: CMOS; Output Drive (IOL/IOH)(Max)(mA): 32/-32; 3-State Output: No; Logic: True; ICC @ Nom Voltage(Max)(mA): 0.01; Voltage(Nom)(V): 1.8,2.5,3.3,5; Rating: Catalog; Schmitt Trigger: Yes; Technology Family: LVC; PackageReference: DCK0005A; DatasheetVersion: SCES351V; Generic Part Number: SN74LVC1G17; Operating Temperature Range(C): -40 to 125,-40 to 85; PartId: 1